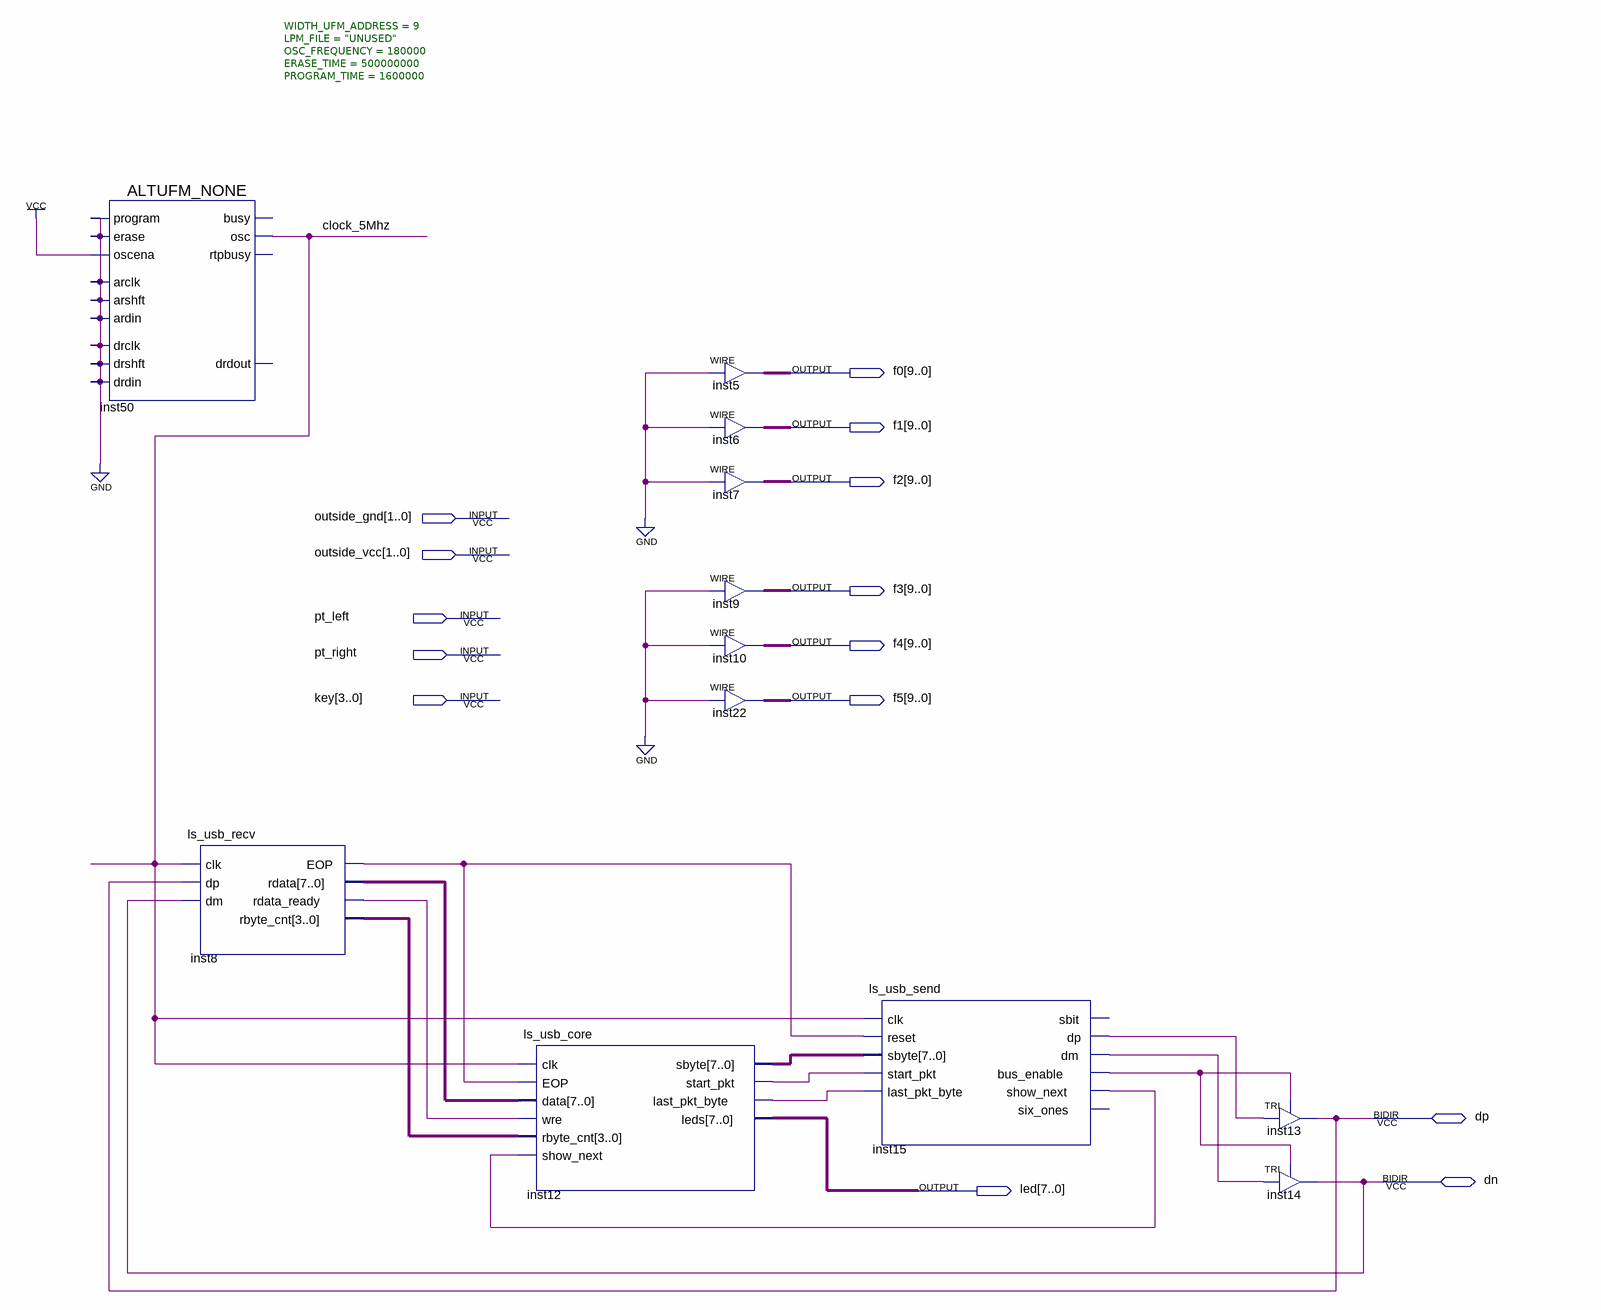
[diagram p0: schematic sheet]
// Quartus schematic max2.bdf as structural Verilog: 12 symbols, 14 pins
module max2 (
  input  [1:0] outside_gnd,
  input  [1:0] outside_vcc,
  input  pt_left,
  input  pt_right,
  input  [3:0] key,
  inout  dp,
  inout  dn,
  output [9:0] f0,
  output [9:0] f1,
  output [9:0] f2,
  output [9:0] f3,
  output [9:0] f4,
  output [9:0] f5,
  output [7:0] led
);

  wire clock_5Mhz, inst8_eop, inst8_rdata_ready, inst12_last_pkt_byte, inst12_start_pkt, inst15_bus_enable,
       inst15_dm, inst15_dp, inst15_show_next;
  wire [3:0] inst8_rbyte_cnt;
  wire [7:0] inst8_rdata, inst12_sbyte;

  ALTUFM_NONE #(.WIDTH_UFM_ADDRESS(9), .LPM_FILE("UNUSED"), .OSC_FREQUENCY(180000), .ERASE_TIME(500000000), .PROGRAM_TIME(1600000)) inst50 (
    .\program (1'b0), .erase(1'b0), .oscena(1'b1), .arclk(1'b0), .arshft(1'b0), .ardin(1'b0), .drclk(1'b0),
    .drshft(1'b0), .drdin(1'b0), .osc(clock_5Mhz));  // open: busy, rtpbusy, drdout
  ls_usb_recv inst8 (
    .clk(clock_5Mhz), .dp(dp), .dm(dn), .EOP(inst8_eop), .rdata(inst8_rdata),
    .rdata_ready(inst8_rdata_ready), .rbyte_cnt(inst8_rbyte_cnt));
  ls_usb_core inst12 (
    .clk(clock_5Mhz), .EOP(inst8_eop), .data(inst8_rdata), .wre(inst8_rdata_ready),
    .rbyte_cnt(inst8_rbyte_cnt), .show_next(inst15_show_next), .sbyte(inst12_sbyte),
    .start_pkt(inst12_start_pkt), .last_pkt_byte(inst12_last_pkt_byte), .leds(led));
  assign f0 = {10{1'b0}};  // WIRE inst5
  assign f1 = {10{1'b0}};  // WIRE inst6
  assign f2 = {10{1'b0}};  // WIRE inst7
  assign f3 = {10{1'b0}};  // WIRE inst9
  assign f4 = {10{1'b0}};  // WIRE inst10
  assign f5 = {10{1'b0}};  // WIRE inst22
  ls_usb_send inst15 (
    .clk(clock_5Mhz), .reset(inst8_eop), .sbyte(inst12_sbyte), .start_pkt(inst12_start_pkt),
    .last_pkt_byte(inst12_last_pkt_byte), .dp(inst15_dp), .dm(inst15_dm), .bus_enable(inst15_bus_enable),
    .show_next(inst15_show_next));  // open: sbit, six_ones
  TRI inst13 (.IN(inst15_dp), .OE(inst15_bus_enable), .OUT(dp));
  TRI inst14 (.IN(inst15_dm), .OE(inst15_bus_enable), .OUT(dn));
endmodule
